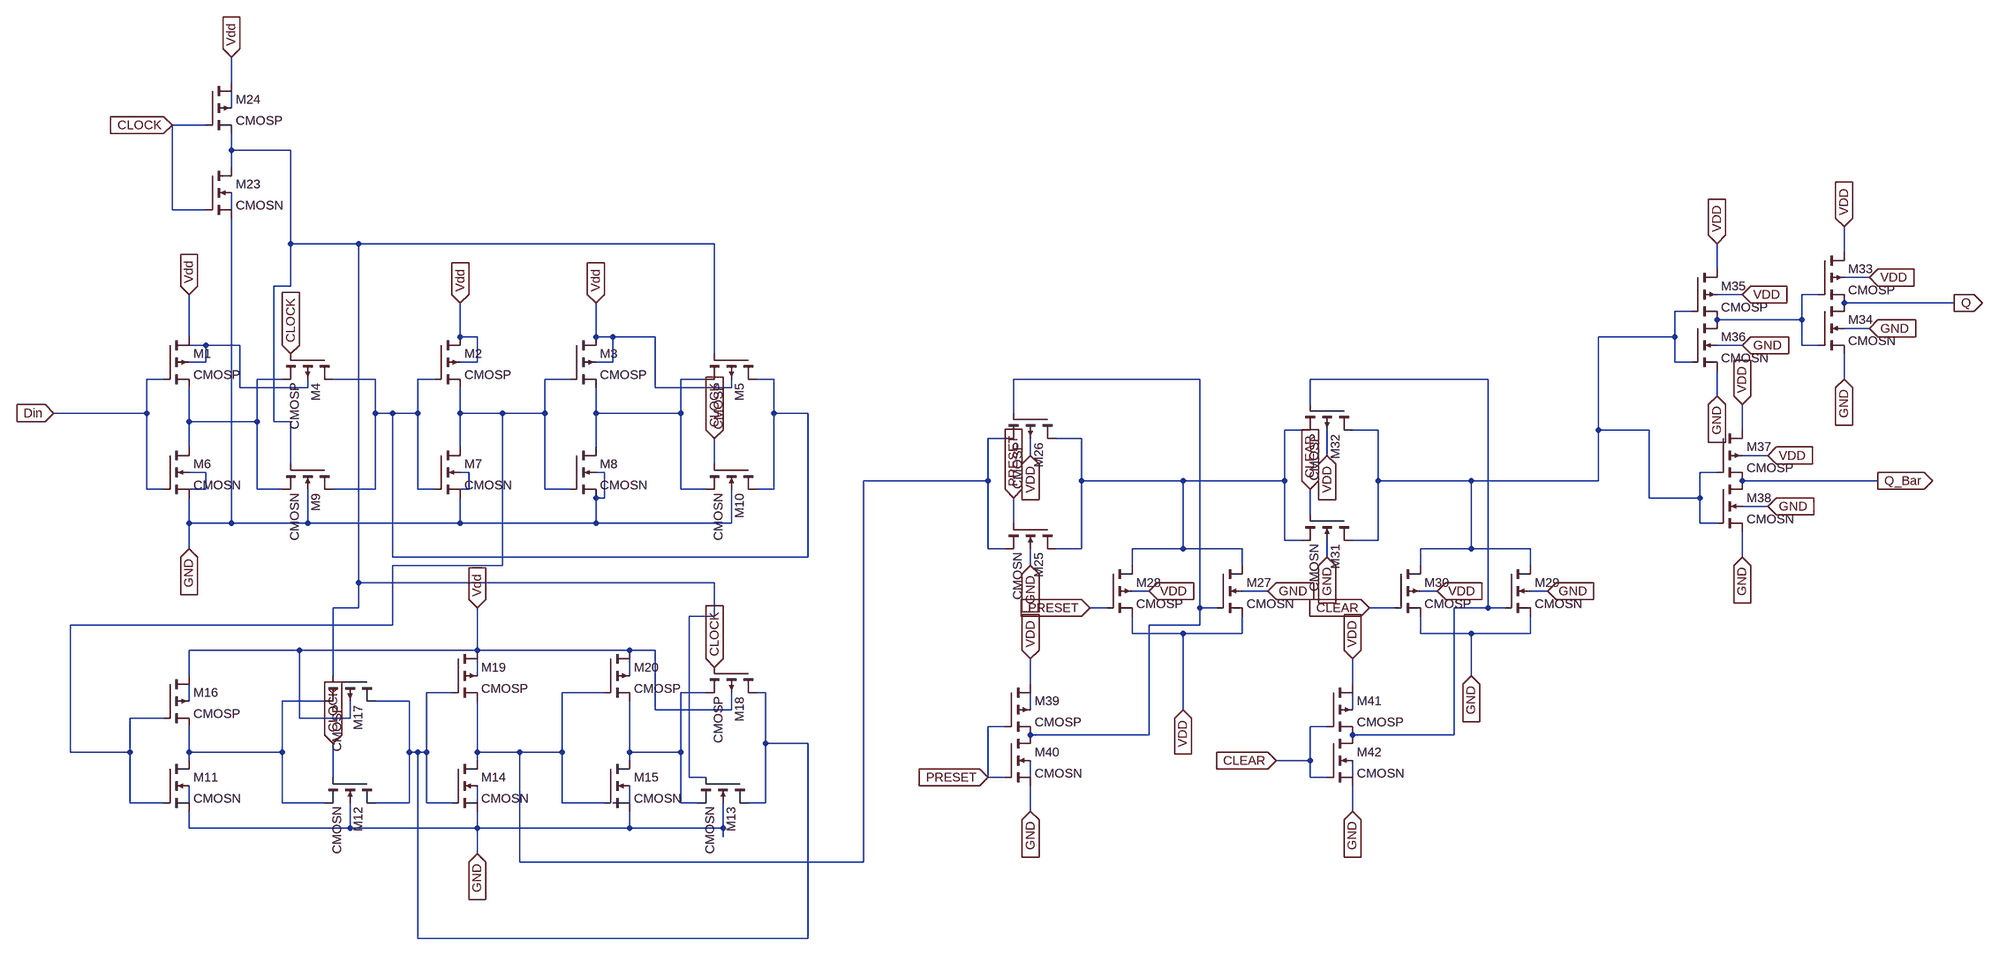
[diagram p0: schematic updated.asc]
updated.asc, the LTspice schematic file:
Version 4
SHEET 1 5004 1540
WIRE 1312 -80 1312 -128
WIRE 1312 -32 1312 -64
WIRE 1264 0 1200 0
WIRE 1312 48 1312 16
WIRE 1424 48 1312 48
WIRE 1312 80 1312 48
WIRE 1200 160 1200 0
WIRE 1264 160 1200 160
WIRE 1312 160 1312 128
WIRE 1424 224 1424 48
WIRE 1552 224 1424 224
WIRE 2224 224 1552 224
WIRE 4720 240 4720 192
WIRE 4480 272 4480 224
WIRE 4768 288 4720 288
WIRE 1424 304 1424 224
WIRE 1424 304 1392 304
WIRE 4528 320 4480 320
WIRE 4672 320 4640 320
WIRE 4928 336 4720 336
WIRE 4432 352 4400 352
WIRE 4640 368 4640 320
WIRE 4640 368 4480 368
WIRE 4768 384 4720 384
WIRE 1232 400 1232 320
WIRE 1744 400 1744 336
WIRE 1776 400 1744 400
WIRE 2000 400 2000 336
WIRE 2032 400 2000 400
WIRE 2112 400 2032 400
WIRE 4400 400 4400 352
WIRE 4400 400 4256 400
WIRE 1264 416 1216 416
WIRE 1328 416 1264 416
WIRE 4528 416 4480 416
WIRE 4640 416 4640 368
WIRE 4672 416 4640 416
WIRE 2224 432 2224 224
WIRE 1264 448 1264 416
WIRE 1264 448 1232 448
WIRE 1776 448 1776 400
WIRE 1776 448 1744 448
WIRE 2032 448 2032 400
WIRE 2032 448 2000 448
WIRE 4400 448 4400 400
WIRE 4432 448 4400 448
WIRE 1184 480 1152 480
WIRE 1408 480 1360 480
WIRE 1584 480 1504 480
WIRE 1696 480 1664 480
WIRE 1952 480 1904 480
WIRE 2208 480 2160 480
WIRE 2336 480 2304 480
WIRE 3504 480 3152 480
WIRE 4048 480 3712 480
WIRE 4720 480 4720 432
WIRE 1328 496 1328 416
WIRE 1456 496 1456 480
WIRE 1456 496 1328 496
WIRE 2112 496 2112 400
WIRE 2256 496 2256 480
WIRE 2256 496 2112 496
WIRE 4480 512 4480 464
WIRE 3712 528 3712 480
WIRE 1152 544 1152 480
WIRE 1152 544 976 544
WIRE 1584 544 1584 480
WIRE 1616 544 1584 544
WIRE 1664 544 1664 480
WIRE 1664 544 1616 544
WIRE 1744 544 1744 496
WIRE 1824 544 1744 544
WIRE 1904 544 1904 480
WIRE 1904 544 1824 544
WIRE 2000 544 2000 496
WIRE 2160 544 2160 480
WIRE 2160 544 2000 544
WIRE 2336 544 2336 480
WIRE 2400 544 2336 544
WIRE 3152 544 3152 480
WIRE 1232 560 1232 496
WIRE 1360 560 1360 480
WIRE 1360 560 1232 560
WIRE 1392 560 1392 304
WIRE 1424 560 1392 560
WIRE 3696 576 3664 576
WIRE 3840 576 3792 576
WIRE 4256 576 4256 400
WIRE 4352 576 4256 576
WIRE 4528 576 4528 528
WIRE 3136 592 3104 592
WIRE 3280 592 3232 592
WIRE 1232 608 1232 560
WIRE 1744 608 1744 544
WIRE 2000 608 2000 544
WIRE 3184 624 3184 592
WIRE 3744 624 3744 576
WIRE 4576 624 4528 624
WIRE 1424 640 1424 560
WIRE 2224 640 2224 592
WIRE 1264 656 1232 656
WIRE 1760 656 1744 656
WIRE 2016 656 2000 656
WIRE 4480 656 4448 656
WIRE 3104 672 3104 592
WIRE 3104 672 2560 672
WIRE 3280 672 3280 592
WIRE 3472 672 3280 672
WIRE 3664 672 3664 576
WIRE 3664 672 3472 672
WIRE 3840 672 3840 576
WIRE 4016 672 3840 672
WIRE 4256 672 4256 576
WIRE 4256 672 4016 672
WIRE 4784 672 4528 672
WIRE 1152 688 1152 544
WIRE 1184 688 1152 688
WIRE 1264 688 1264 656
WIRE 1264 688 1232 688
WIRE 1360 688 1360 560
WIRE 1408 688 1360 688
WIRE 1584 688 1584 544
WIRE 1584 688 1504 688
WIRE 1664 688 1664 544
WIRE 1696 688 1664 688
WIRE 1760 688 1760 656
WIRE 1760 688 1744 688
WIRE 1904 688 1904 544
WIRE 1952 688 1904 688
WIRE 2160 688 2160 544
WIRE 2208 688 2160 688
WIRE 2336 688 2336 544
WIRE 2336 688 2304 688
WIRE 2016 704 2016 656
WIRE 2016 704 2000 704
WIRE 4352 704 4352 576
WIRE 4448 704 4448 656
WIRE 4448 704 4352 704
WIRE 4576 720 4528 720
WIRE 3712 736 3712 688
WIRE 1232 752 1232 704
WIRE 1312 752 1312 176
WIRE 1312 752 1232 752
WIRE 1456 752 1456 688
WIRE 1456 752 1312 752
WIRE 1744 752 1744 704
WIRE 1744 752 1456 752
WIRE 2000 752 2000 704
WIRE 2000 752 1744 752
WIRE 2256 752 2256 688
WIRE 2256 752 2000 752
WIRE 3152 752 3152 704
WIRE 4448 752 4448 704
WIRE 4480 752 4448 752
WIRE 3664 784 3664 672
WIRE 3696 784 3664 784
WIRE 3840 784 3840 672
WIRE 3840 784 3792 784
WIRE 1232 800 1232 752
WIRE 3104 800 3104 672
WIRE 3136 800 3104 800
WIRE 3280 800 3280 672
WIRE 3280 800 3232 800
WIRE 3472 800 3472 672
WIRE 3472 800 3376 800
WIRE 3584 800 3472 800
WIRE 4016 800 4016 672
WIRE 4016 800 3920 800
WIRE 4128 800 4016 800
WIRE 1616 816 1616 544
WIRE 2400 816 2400 544
WIRE 2400 816 1616 816
WIRE 3744 816 3744 784
WIRE 4528 816 4528 768
WIRE 1824 832 1824 544
WIRE 1824 832 1616 832
WIRE 3184 832 3184 800
WIRE 3376 832 3376 800
WIRE 3584 832 3584 800
WIRE 3920 832 3920 800
WIRE 4128 832 4128 800
WIRE 1552 864 1552 224
WIRE 2224 864 1552 864
WIRE 3408 880 3376 880
WIRE 3632 880 3584 880
WIRE 3952 880 3920 880
WIRE 4160 880 4128 880
WIRE 1552 912 1552 864
WIRE 1552 912 1504 912
WIRE 3328 912 3296 912
WIRE 3504 912 3504 480
WIRE 3536 912 3504 912
WIRE 3872 912 3824 912
WIRE 4048 912 4048 480
WIRE 4048 912 3984 912
WIRE 4080 912 4048 912
WIRE 2224 928 2224 864
WIRE 2224 928 2176 928
WIRE 1616 944 1616 832
WIRE 1616 944 1008 944
WIRE 3504 944 3504 912
WIRE 3504 944 3408 944
WIRE 3376 960 3376 928
WIRE 3472 960 3376 960
WIRE 3584 960 3584 928
WIRE 3584 960 3472 960
WIRE 3920 960 3920 928
WIRE 4016 960 3920 960
WIRE 4128 960 4128 928
WIRE 4128 960 4016 960
WIRE 1440 992 1232 992
WIRE 1776 992 1776 912
WIRE 1776 992 1440 992
WIRE 2064 992 1776 992
WIRE 2112 992 2064 992
WIRE 1232 1040 1232 992
WIRE 1504 1040 1504 912
WIRE 1776 1040 1776 1008
WIRE 2064 1040 2064 1008
WIRE 4016 1040 4016 960
WIRE 3184 1056 3184 1008
WIRE 3792 1056 3792 1008
WIRE 1728 1072 1680 1072
WIRE 2016 1072 1936 1072
WIRE 2208 1072 2160 1072
WIRE 2320 1072 2304 1072
WIRE 3792 1072 3776 1072
WIRE 1232 1088 1232 1056
WIRE 1488 1088 1408 1088
WIRE 1648 1088 1584 1088
WIRE 2112 1104 2112 992
WIRE 2256 1104 2256 1072
WIRE 2256 1104 2112 1104
WIRE 3184 1104 3184 1072
WIRE 3472 1104 3472 960
WIRE 3792 1104 3792 1072
WIRE 1184 1120 1120 1120
WIRE 1440 1120 1440 992
WIRE 1536 1120 1536 1088
WIRE 1536 1120 1440 1120
WIRE 3136 1136 3104 1136
WIRE 3744 1136 3712 1136
WIRE 3408 1152 3408 944
WIRE 3408 1152 3184 1152
WIRE 3984 1152 3984 912
WIRE 3984 1152 3792 1152
WIRE 2320 1168 2320 1072
WIRE 2400 1168 2320 1168
WIRE 1008 1184 1008 944
WIRE 1120 1184 1120 1120
WIRE 1120 1184 1008 1184
WIRE 1232 1184 1232 1136
WIRE 1408 1184 1408 1088
WIRE 1408 1184 1232 1184
WIRE 1648 1184 1648 1088
WIRE 1664 1184 1648 1184
WIRE 1680 1184 1680 1072
WIRE 1680 1184 1664 1184
WIRE 1776 1184 1776 1088
WIRE 1856 1184 1776 1184
WIRE 1936 1184 1936 1072
WIRE 1936 1184 1856 1184
WIRE 2064 1184 2064 1088
WIRE 2160 1184 2160 1072
WIRE 2160 1184 2064 1184
WIRE 1232 1200 1232 1184
WIRE 1776 1200 1776 1184
WIRE 2064 1200 2064 1184
WIRE 3712 1200 3712 1136
WIRE 3712 1200 3648 1200
WIRE 1504 1232 1504 1168
WIRE 2176 1232 2176 928
WIRE 2208 1232 2176 1232
WIRE 3104 1232 3104 1136
WIRE 3136 1232 3104 1232
WIRE 3184 1232 3184 1200
WIRE 3712 1232 3712 1200
WIRE 3744 1232 3712 1232
WIRE 3792 1232 3792 1200
WIRE 1120 1280 1120 1184
WIRE 1184 1280 1120 1280
WIRE 1232 1280 1232 1248
WIRE 1408 1280 1408 1184
WIRE 1488 1280 1408 1280
WIRE 1648 1280 1648 1184
WIRE 1648 1280 1584 1280
WIRE 1680 1280 1680 1184
WIRE 1728 1280 1680 1280
WIRE 1776 1280 1776 1248
WIRE 1936 1280 1936 1184
WIRE 2016 1280 1936 1280
WIRE 2064 1280 2064 1248
WIRE 2064 1280 2032 1280
WIRE 2160 1280 2160 1184
WIRE 2192 1280 2160 1280
WIRE 2320 1280 2320 1168
WIRE 2320 1280 2288 1280
WIRE 3184 1296 3184 1248
WIRE 3792 1296 3792 1248
WIRE 1232 1328 1232 1296
WIRE 1536 1328 1536 1280
WIRE 1536 1328 1232 1328
WIRE 1776 1328 1776 1296
WIRE 1776 1328 1536 1328
WIRE 2064 1328 2064 1296
WIRE 2064 1328 1776 1328
WIRE 2240 1328 2240 1280
WIRE 2240 1328 2064 1328
WIRE 2240 1344 2240 1328
WIRE 1776 1376 1776 1328
WIRE 1856 1392 1856 1184
WIRE 2560 1392 2560 672
WIRE 2560 1392 1856 1392
WIRE 1664 1536 1664 1184
WIRE 2400 1536 2400 1168
WIRE 2400 1536 1664 1536
FLAG 1232 320 Vdd
IOPIN 1232 320 In
FLAG 1744 336 Vdd
IOPIN 1744 336 In
FLAG 2000 336 Vdd
IOPIN 2000 336 In
FLAG 976 544 Din
IOPIN 976 544 In
FLAG 1232 800 GND
IOPIN 1232 800 In
FLAG 1776 912 Vdd
IOPIN 1776 912 In
FLAG 1776 1376 GND
IOPIN 1776 1376 In
FLAG 1312 -128 Vdd
IOPIN 1312 -128 In
FLAG 1200 0 CLOCK
IOPIN 1200 0 In
FLAG 3184 624 VDD
IOPIN 3184 624 In
FLAG 3408 880 VDD
IOPIN 3408 880 In
FLAG 3472 1104 VDD
IOPIN 3472 1104 In
FLAG 3952 880 VDD
IOPIN 3952 880 In
FLAG 3744 624 VDD
IOPIN 3744 624 In
FLAG 4528 528 VDD
IOPIN 4528 528 In
FLAG 4480 224 VDD
IOPIN 4480 224 In
FLAG 4720 192 VDD
IOPIN 4720 192 In
FLAG 4480 512 GND
IOPIN 4480 512 In
FLAG 4720 480 GND
IOPIN 4720 480 In
FLAG 4528 416 GND
IOPIN 4528 416 In
FLAG 4768 384 GND
IOPIN 4768 384 In
FLAG 4576 720 GND
IOPIN 4576 720 In
FLAG 4528 816 GND
IOPIN 4528 816 In
FLAG 3744 816 GND
IOPIN 3744 816 In
FLAG 4160 880 GND
IOPIN 4160 880 In
FLAG 3632 880 GND
IOPIN 3632 880 In
FLAG 3184 832 GND
IOPIN 3184 832 In
FLAG 3152 704 PRESET
IOPIN 3152 704 In
FLAG 3296 912 PRESET
IOPIN 3296 912 In
FLAG 3712 688 CLEAR
IOPIN 3712 688 In
FLAG 3824 912 CLEAR
IOPIN 3824 912 In
FLAG 4576 624 VDD
IOPIN 4576 624 In
FLAG 4528 320 VDD
IOPIN 4528 320 In
FLAG 4768 288 VDD
IOPIN 4768 288 In
FLAG 4928 336 Q
IOPIN 4928 336 Out
FLAG 4784 672 Q_Bar
IOPIN 4784 672 Out
FLAG 4016 1040 GND
IOPIN 4016 1040 In
FLAG 3184 1008 VDD
IOPIN 3184 1008 In
FLAG 3184 1296 GND
IOPIN 3184 1296 In
FLAG 3792 1008 VDD
IOPIN 3792 1008 In
FLAG 3792 1296 GND
IOPIN 3792 1296 In
FLAG 3648 1200 CLEAR
IOPIN 3648 1200 In
FLAG 3104 1232 PRESET
IOPIN 3104 1232 In
FLAG 1424 432 CLOCK
IOPIN 1424 432 In
FLAG 2224 592 CLOCK
IOPIN 2224 592 In
FLAG 1504 1168 CLOCK
IOPIN 1504 1168 In
FLAG 2224 1024 CLOCK
IOPIN 2224 1024 In
SYMBOL cmosp 1184 400 R0
SYMATTR InstName M1
SYMATTR Value2 l=180n w=4u
SYMBOL cmosp 1696 400 R0
SYMATTR InstName M2
SYMATTR Value2 l=180n w=4u
SYMBOL cmosp 1952 400 R0
SYMATTR InstName M3
SYMATTR Value2 l=180n w=4u
SYMBOL cmosp 1504 432 R90
SYMATTR InstName M4
SYMATTR Value2 l=180n w=4u
SYMBOL cmosp 2304 432 R90
SYMATTR InstName M5
SYMATTR Value2 l=180n w=4u
SYMBOL cmosn 1184 608 R0
SYMATTR InstName M6
SYMATTR Value2 l=180n w=2u
SYMBOL cmosn 1696 608 R0
SYMATTR InstName M7
SYMATTR Value2 l=180n w=2u
SYMBOL cmosn 1952 608 R0
SYMATTR InstName M8
SYMATTR Value2 l=180n w=2u
SYMBOL cmosn 1504 640 R90
SYMATTR InstName M9
SYMATTR Value2 l=180n w=2u
SYMBOL cmosn 2304 640 R90
SYMATTR InstName M10
SYMATTR Value2 l=180n w=2u
SYMBOL cmosn 1184 1200 R0
SYMATTR InstName M11
SYMATTR Value2 l=180n w=2u
SYMBOL cmosn 1584 1232 R90
SYMATTR InstName M12
SYMATTR Value2 l=180n w=2u
SYMBOL cmosn 2288 1232 R90
SYMATTR InstName M13
SYMATTR Value2 l=180n w=2u
SYMBOL cmosn 1728 1200 R0
SYMATTR InstName M14
SYMATTR Value2 l=180n w=2u
SYMBOL cmosn 2016 1200 R0
SYMATTR InstName M15
SYMATTR Value2 l=180n w=2u
SYMBOL cmosp 1184 1040 R0
SYMATTR InstName M16
SYMATTR Value2 l=180n w=4u
SYMBOL cmosp 1584 1040 R90
SYMATTR InstName M17
SYMATTR Value2 l=180n w=4u
SYMBOL cmosp 2304 1024 R90
SYMATTR InstName M18
SYMATTR Value2 l=180n w=4u
SYMBOL cmosp 1728 992 R0
SYMATTR InstName M19
SYMATTR Value2 l=180n w=4u
SYMBOL cmosp 2016 992 R0
SYMATTR InstName M20
SYMATTR Value2 l=180n w=4u
SYMBOL cmosn 1264 80 R0
SYMATTR InstName M23
SYMATTR Value2 l=180n w=2u
SYMBOL cmosp 1264 -80 R0
SYMATTR InstName M24
SYMATTR Value2 l=180n w=4u
SYMBOL cmosn 3232 752 R90
SYMATTR InstName M25
SYMATTR Value2 l=180n w=2u
SYMBOL cmosp 3232 544 R90
SYMATTR InstName M26
SYMATTR Value2 l=180n w=4u
SYMBOL cmosn 3536 832 R0
SYMATTR InstName M27
SYMATTR Value2 l=180n w=2u
SYMBOL cmosp 3328 832 R0
SYMATTR InstName M28
SYMATTR Value2 l=180n w=4u
SYMBOL cmosn 4080 832 R0
SYMATTR InstName M29
SYMATTR Value2 l=180n w=2u
SYMBOL cmosp 3872 832 R0
SYMATTR InstName M30
SYMATTR Value2 l=180n w=4u
SYMBOL cmosn 3792 736 R90
SYMATTR InstName M31
SYMATTR Value2 l=180n w=2u
SYMBOL cmosp 3792 528 R90
SYMATTR InstName M32
SYMATTR Value2 l=180n w=4u
SYMBOL cmosp 4672 240 R0
SYMATTR InstName M33
SYMATTR Value2 l=180n w=4u
SYMBOL cmosn 4672 336 R0
SYMATTR InstName M34
SYMATTR Value2 l=180n w=2u
SYMBOL cmosp 4432 272 R0
SYMATTR InstName M35
SYMATTR Value2 l=180n w=4u
SYMBOL cmosn 4432 368 R0
SYMATTR InstName M36
SYMATTR Value2 l=180n w=2u
SYMBOL cmosp 4480 576 R0
SYMATTR InstName M37
SYMATTR Value2 l=180n w=4u
SYMBOL cmosn 4480 672 R0
SYMATTR InstName M38
SYMATTR Value2 l=180n w=2u
SYMBOL cmosp 3136 1056 R0
SYMATTR InstName M39
SYMATTR Value2 l=180n w=4u
SYMBOL cmosn 3136 1152 R0
SYMATTR InstName M40
SYMATTR Value2 l=180n w=2u
SYMBOL cmosp 3744 1056 R0
SYMATTR InstName M41
SYMATTR Value2 l=180n w=4u
SYMBOL cmosn 3744 1152 R0
SYMATTR InstName M42
SYMATTR Value2 l=180n w=2u

The netlist it stands for:
* updated.asc
M1 Vdd Din N007 N006 CMOSP l=180n w=4u
M2 Vdd N008 N009 Vdd CMOSP l=180n w=4u
M3 Vdd N009 N010 Vdd CMOSP l=180n w=4u
M4 N008 CLOCK N007 N006 CMOSP l=180n w=4u
M5 N008 N002 N010 Vdd CMOSP l=180n w=4u
M6 N007 Din GND N015 CMOSN l=180n w=2u
M7 N009 N008 GND N016 CMOSN l=180n w=2u
M8 N010 N009 GND GND CMOSN l=180n w=2u
M9 N008 N002 N007 GND CMOSN l=180n w=2u
M10 N008 CLOCK N010 GND CMOSN l=180n w=2u
M11 N023 N009 GND N027 CMOSN l=180n w=2u
M12 N019 CLOCK N023 GND CMOSN l=180n w=2u
M13 N019 N002 N020 GND CMOSN l=180n w=2u
M14 N014 N019 GND N028 CMOSN l=180n w=2u
M15 N020 N014 GND N029 CMOSN l=180n w=2u
M16 Vdd N009 N023 N022 CMOSP l=180n w=4u
M17 N019 N002 N023 Vdd CMOSP l=180n w=4u
M18 N019 CLOCK N020 Vdd CMOSP l=180n w=4u
M19 Vdd N019 N014 N017 CMOSP l=180n w=4u
M20 Vdd N014 N020 N018 CMOSP l=180n w=4u
M23 N002 CLOCK GND N003 CMOSN l=180n w=2u
M24 Vdd CLOCK N002 N001 CMOSP l=180n w=4u
M25 N013 PRESET N014 GND CMOSN l=180n w=2u
M26 N013 N011 N014 Vdd CMOSP l=180n w=4u
M27 N013 N011 Vdd GND CMOSN l=180n w=2u
M28 N013 PRESET Vdd Vdd CMOSP l=180n w=4u
M29 N005 N012 GND GND CMOSN l=180n w=2u
M30 N005 CLEAR GND Vdd CMOSP l=180n w=4u
M31 N005 CLEAR N013 GND CMOSN l=180n w=2u
M32 N005 N012 N013 Vdd CMOSP l=180n w=4u
M33 Vdd N004 Q Vdd CMOSP l=180n w=4u
M34 Q N004 GND GND CMOSN l=180n w=2u
M35 Vdd N005 N004 Vdd CMOSP l=180n w=4u
M36 N004 N005 GND GND CMOSN l=180n w=2u
M37 Vdd N005 Q_Bar Vdd CMOSP l=180n w=4u
M38 Q_Bar N005 GND GND CMOSN l=180n w=2u
M39 Vdd PRESET N011 N024 CMOSP l=180n w=4u
M40 N011 PRESET GND N025 CMOSN l=180n w=2u
M41 Vdd CLEAR N012 N021 CMOSP l=180n w=4u
M42 N012 CLEAR GND N026 CMOSN l=180n w=2u
.model NMOS NMOS
.model PMOS PMOS
.lib standard.mos
.backanno
.end